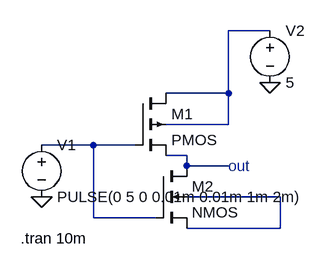
[diagram p0: schematic not gate.asc]
not gate.asc, the LTspice schematic file:
Version 4
SHEET 1 880 680
WIRE 384 32 320 32
WIRE 320 128 320 32
WIRE 320 128 224 128
WIRE 320 176 320 128
WIRE 320 176 224 176
WIRE 112 208 32 208
WIRE 176 208 112 208
WIRE 256 224 224 224
WIRE 256 240 256 224
WIRE 320 240 256 240
WIRE 400 288 256 288
WIRE 112 320 112 208
WIRE 208 320 112 320
WIRE 400 336 400 288
WIRE 400 336 256 336
FLAG 384 112 0
FLAG 32 288 0
SYMBOL pmos4 176 128 R0
SYMATTR InstName M1
SYMBOL nmos4 208 240 R0
SYMATTR InstName M2
SYMBOL voltage 32 192 R0
WINDOW 123 0 0 Left 0
WINDOW 39 0 0 Left 0
SYMATTR InstName V1
SYMATTR Value PULSE(0 5 0 0.01m 0.01m 1m 2m)
SYMBOL voltage 384 16 R0
WINDOW 123 0 0 Left 0
WINDOW 39 0 0 Left 0
SYMATTR InstName V2
SYMATTR Value 5
TEXT 0 352 Left 2 !.tran 10m
TEXT 320 240 Left 2 ;out

The netlist it stands for:
* not gate.asc
M1 N001 N002 N003 N001 PMOS
M2 N003 N002 N004 N004 NMOS
V1 N002 0 PULSE(0 5 0 0.01m 0.01m 1m 2m)
V2 N001 0 5
.model NMOS NMOS
.model PMOS PMOS
.lib standard.mos
.tran 10m
* out
.backanno
.end